# Altium schematic sheet EVQPUC02K_2023-10-04.schdoc
size 41 x 27 mm
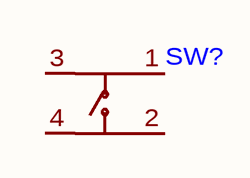
[diagram p0: EVQPUC02K_2023-10-04.schdoc]

## Parts
SW?  (no value)  [SW-SMD_EVQPUD02K]

## Nets

Not connected (* = marked no-connect by the designer): SW? 1 2 3 4

## Library data of the parts
SW? = EVQPUC02K